# EAGLE design pcm5102dac (EAGLE 6.4)
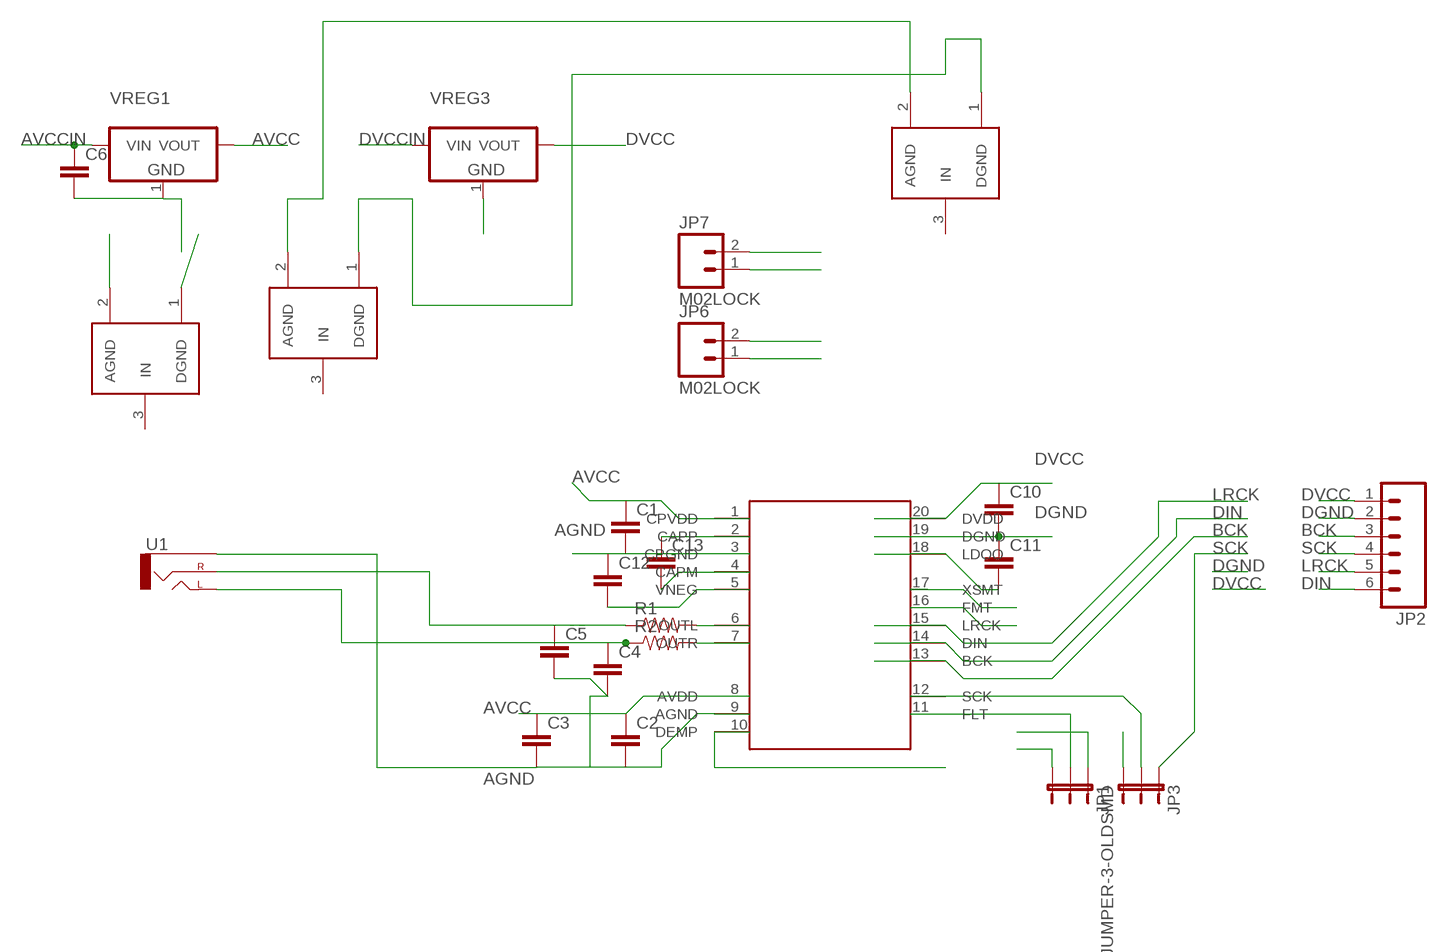
[diagram p0: schematic, sheet 1]

## Parts
C1  CAP0805  [0805]
C2  CAP0805  [0805]
C3  CAP0805  [0805]
C4  CAPPTH1  [CAP-PTH-5MM]
C5  CAPPTH1  [CAP-PTH-5MM]
C6  CAP0805  [0805]
C10  CAP0805  [0805]
C11  CAP0805  [0805]
C12  CAP0805  [0805]
C13  CAP0805  [0805]
JP1  JUMPER-3-OLDPTH  [1X03]
JP2  M06LOCK  [1X06_LOCK]
JP3  JUMPER-3-OLDSMD  [SJ_3]
JP6  M02LOCK  [1X02_LOCK]
JP7  M02LOCK  [1X02_LOCK]
R1  RESISTORPTH-1/4W  [AXIAL-0.4]
R2  RESISTORPTH-1/4W  [AXIAL-0.4]
U1  AUDIO-JACKPTH  [AUDIO-JACK]
U$1  PCM5102  [TSSOP20]
U$2  GND_CONNECT  [GND_CONNECT]
U$3  GND_CONNECT  [GND_CONNECT]
U$4  GND_CONNECT  [GND_CONNECT]
VREG1  VREG_3PINS-SOT-223  [SOT-223]
VREG3  VREG_3PINS-SOT-223  [SOT-223]

## Nets
AGND: C1.2 C2.2 C3.2 C4.2 C5.2 C6.2 C12.1 JP6.1 U1.SLEEVE U$1.3(CPGND) U$1.9(AGND) U$2.2(AGND) U$3.2(AGND) U$4.2(AGND) VREG1.1(GND)
AVCC: C1.1 C2.1 C3.1 U$1.1(CPVDD) U$1.8(AVDD) VREG1.2(VOUT)
AVCCIN: C6.1 JP6.2 VREG1.3(VIN)
BCK: JP2.3 U$1.13(BCK)
DGND: C10.2 C11.1 JP1.1 JP2.2 JP3.3 JP7.1 U$1.10(DEMP) U$1.16(FMT) U$1.19(DGND) U$2.1(DGND) U$3.1(DGND) U$4.1(DGND) VREG3.1(GND)
DIN: JP2.6 U$1.14(DIN)
DVCC: C10.1 JP1.3 JP2.1 U$1.20(DVDD) VREG3.2(VOUT)
DVCCIN: JP7.2 VREG3.3(VIN)
DVDD: U$1.17(XSMT)
LRCK: JP2.5 U$1.15(LRCK)
N$1: C11.2 U$1.18(LDOO)
N$2: R1.P$2 U$1.6(OUTL)
N$3: JP1.2 U$1.11(FLT)
N$5: C13.1 U$1.2(CAPP)
N$6: C13.2 U$1.4(CAPM)
N$7: C12.2 U$1.5(VNEG)
N$8: R2.P$2 U$1.7(OUTR)
N$11: C5.1 R1.P$1 U1.RING(RIGHT)
N$12: C4.1 R2.P$1 U1.TIP(LEFT)
SCK: JP2.4 JP3.1
SCKI: JP3.2 U$1.12(SCK)
Unconnected: U$2.3(IN) U$3.3(IN) U$4.3(IN)

## Library data of the parts
C1-C6 C10-C13 = SparkFun-Capacitors:CAP: Capacitor Standard 0603 ceramic capacitor, and 0.1" leaded capacitor.
JP1 JP3 = SparkFun-Passives:JUMPER-3-OLD
JP2 = SparkFun-Connectors:M06: Header 6 Standard 6-pin 0.1" header. Use with straight break away headers (SKU : PRT-00116), right angle break away headers (PRT-00553), swiss pins (PRT-00743), machine pins (PRT-00117), and female headers (PRT-00115). Molex polarized connector foot print use with SKU : PRT-08094 with associated crimp pins and housings. NOTES ON THE VARIANTS LOCK and LOCK_LONGPADS... This footprint was designed to help hold the alignment of a through-hole component (i.e. 6-pin header) while soldering it into place. You may notice that each hole has been shifted either up or down by 0.005 of an inch from it's more standard position (which is a perfectly straight line). This slight alteration caused the pins (the squares in the middle) to touch the edges of the holes. Because they are alternating, it causes a "brace" to hold the component in place. 0.005 has proven to be the perfect amount of "off-center" position when using our standard breakaway headers. Although looks a little odd when you look at the bare footprint, once you have a header in there, the alteration is very hard to notice. Also,if you push a header all the way into place, it is covered up entirely on the bottom side. This idea of altering the position of holes to aid alignment will be further integrated into the Sparkfun Library for other footprints. It can help hold any component with 3 or more connection pins.
JP6 JP7 = SparkFun-Connectors:M02: Standard 2-pin 0.1" header. Use with - straight break away headers ( PRT-00116) - right angle break away headers (PRT-00553) - swiss pins (PRT-00743) - machine pins (PRT-00117) - female headers (PRT-00115) Molex polarized connector foot print use with: PRT-08233 with associated crimp pins and housings. 2.54_SCREWTERM for use with PRT-10571. 3.5mm Screw Terminal footprints for PRT-08084 5mm Screw Terminal footprints for use with PRT-08433
R1 R2 = SparkFun-Resistors:RESISTOR: Resistor Basic schematic elements and footprints for 0603, 1206, and PTH resistors.
U1 = SparkFun-Connectors:AUDIO-JACK: 3.5mm Audio Jack Simple 3.5mm common PCB mount audio jack. SKU: PRT-08032
U$1 = adafruit:PCM5102
U$2-U$4 = SparkFun-Passives:GND_CONNECT: Use to make a connection of multiple grounds in only one place.
VREG1 VREG3 = dp_devices:VREG_3PINS: Various 3 pin voltage regulators in different packages Double check the right pinout for the right part

## Net classes
0 default: width 0.254 mm

## Board
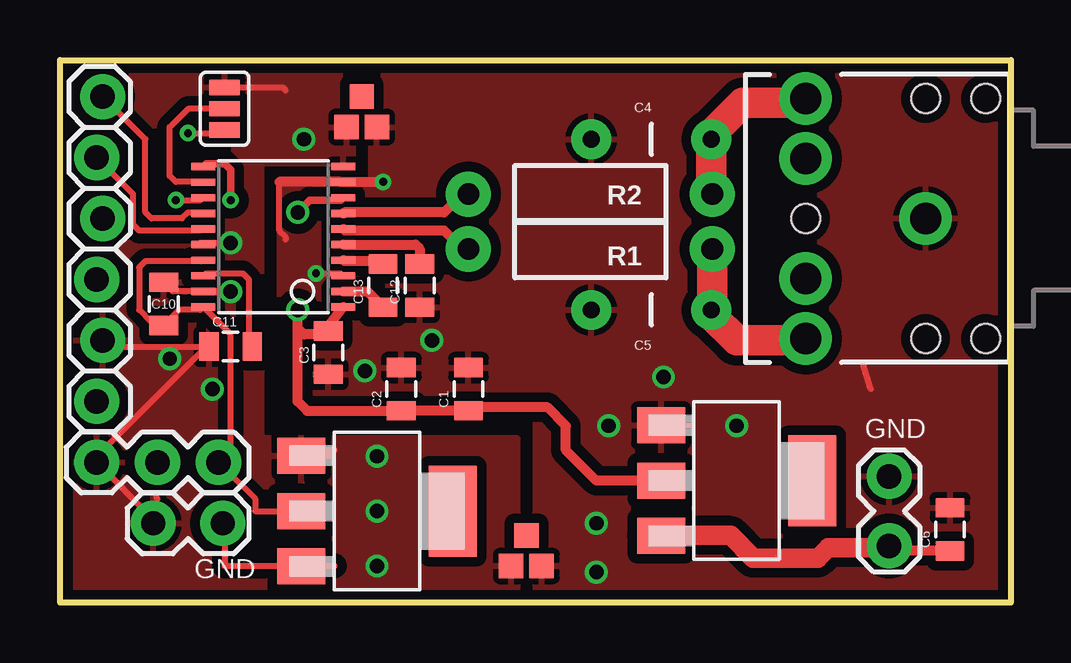
[diagram p1: board, top side]
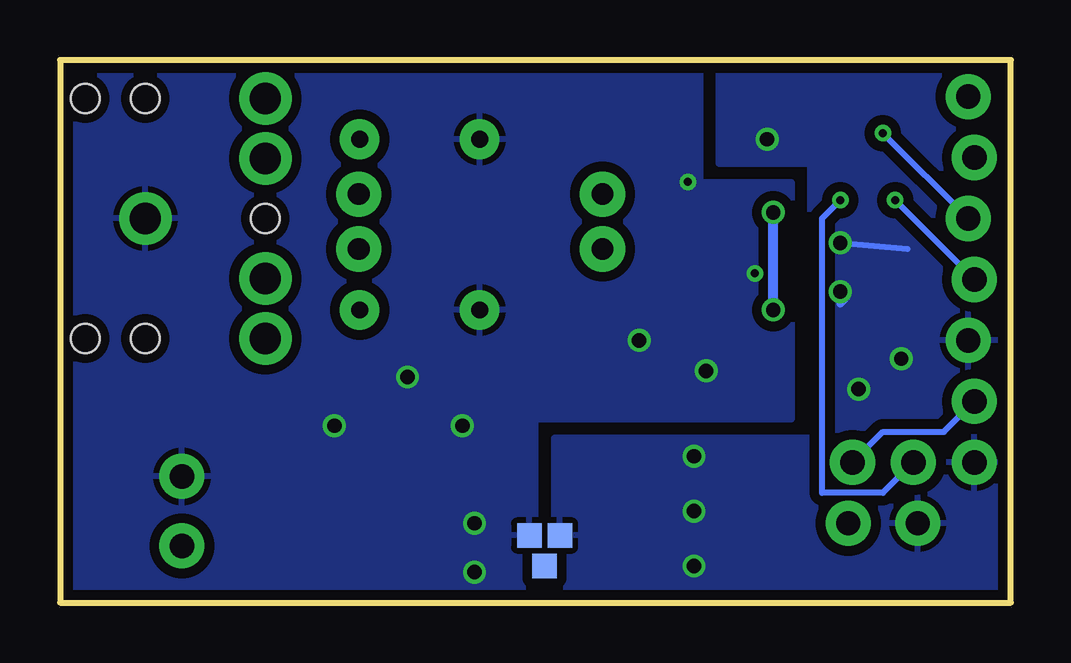
[diagram p2: board, bottom side, seen from below]

Size 39.62 x 22.61 mm. Coordinates in mm from the lower left corner, seen from the top.
Outline: 0,22.61 39.62,22.61 39.62,0 0,0 0,22.61
Copper layers (1*16): Top 0.0356mm / dielectric 1.5011mm / Bottom 0.0356mm
Design rules "LaenPCBOrder *": minimum track width 6mil, minimum drill 13mil, track to track 6mil, track to pad 6mil, pad to pad 6mil, via to via 6mil, smd to smd 6mil, copper to edge 15mil, drill to drill 6mil, minimum pad ring 7mil, minimum via ring 7mil, stop-mask expansion 3mil, vias tented up to drill 3mil, thermal gap 10mil

### Footprints (pad centres in the part's own frame; a part is rotated, then mirrored left to right if it is on the bottom)
0805 = smd 0.8 x 1.2: 1 -0.9,0; 2 0.9,0
CAP-PTH-5MM = drill 0.7 pad 1.651: 1 -2.5,0; 2 2.5,0
1X03 = drill 1.016 pad 1.88: 1 0,0; 2 2.54,0; 3 5.08,0
1X06_LOCK = drill 1.016 pad 1.88: 1 0,0; 2 2.54,-0.254; 3 5.08,0; 4 7.62,-0.254; 5 10.16,0; 6 12.7,-0.254
SJ_3 = smd 0.635 x 1.27: 1 -0.889,0; 2 0,0; 3 0.889,0
1X02_LOCK = drill 1.016 pad 1.88: 1 -0.178,0; 2 2.718,0
AXIAL-0.4 = drill 0.9 pad 1.88: P$1 -5.08,0; P$2 5.08,0
AUDIO-JACK = drill 1.3 pad 2.184: RING 5,5; RSH 5,2.5; SLEEVE 0,0; TIP 5,-5; TSH 5,-2.5 | hole 1.2: 0,5; -2.5,5; -2.5,-5; 0,-5; 5,0
TSSOP20 = smd 0.305 x 0.991: 1 -2.925,-2.918; 2 -2.275,-2.918; 3 -1.625,-2.918; 4 -0.975,-2.918; 5 -0.325,-2.918; 6 0.325,-2.918; 7 0.975,-2.918; 8 1.625,-2.918; 9 2.275,-2.918; 10 2.925,-2.918; 11 2.925,2.918; 12 2.275,2.918; 13 1.625,2.918; 14 0.975,2.918; 15 0.325,2.918; 16 -0.325,2.918; 17 -0.975,2.918; 18 -1.625,2.918; 19 -2.275,2.918; 20 -2.925,2.918
GND_CONNECT = smd 1.016 x 1.016: 1 -1.016,0; 2 -1.016,-1.27; 3 0.254,-0.635
SOT-223 = smd 1.5 x 2: 1 -2.3,-3.15; 2 0,-3.15; 3 2.3,-3.15 | smd 3.8 x 2: 4 0,3.15

### Placement (x,y rotation side)
C1  17.02,8.89 90 top
C2  14.22,8.89 90 top
C3  11.18,10.41 270 top
C4  24.64,19.3 180 top
C5  24.64,12.19 180 top
C6  37.08,3.05 90 top
C10  4.32,12.45 90 top
C11  7.11,10.67 0 top
C12  14.99,13.21 90 top
C13  13.46,13.21 90 top
JP1  1.52,5.84 0 top
JP2  1.52,8.38 90 top
JP3  6.86,20.57 90 top
JP6  34.54,5.08 270 top
JP7  4.06,3.3 0 top
R1  22.1,14.73 180 top
R2  22.1,17.02 180 top
U1  36.07,16 180 top
U$1  8.89,15.24 90 top
U$2  18.8,2.54 90 top
U$3  18.8,1.78 270 bottom
U$4  11.94,20.83 90 top
VREG1  28.19,5.08 270 top
VREG3  13.21,3.81 270 top

### Tracks (layer width: path | path; a pad name or v marks a point on that pad's centre or on a via)
AGND  (via drill 0.33, 0.6)
  Top 0.254: 33.78,8.89 33.45,9.98 | 22.86,12.19 C5.2 | v10.67,13.72 11.68,13.72 U$1.3 | 9.14,17.53 9.14,15.49 9.4,15.24 9.4,15.12 | 11.68,17.53 U$1.9
  Top 0.406: 13.21,17.53 11.68,17.53 9.14,17.53
  other vias: 12.7,9.65 25.15,9.4 22.35,1.27 15.49,10.92 13.46,17.53 22.35,3.3 28.19,7.37 22.86,7.37
  pour Top (isolate 0.406): 12.95,24.89 12.95,17.53 9.14,17.53 9.14,7.62 19.81,7.62 19.81,-2.54 41.66,-2.54 41.66,24.89
  pour Bottom (isolate 0.406): 12.95,24.89 12.95,17.53 9.14,17.53 9.14,7.62 19.81,7.62 19.81,-2.54 41.66,-2.54 41.66,24.89
AVCC  (via drill 0.6)
  Top 0.305: U$1.8 11.71,16.76 10.41,16.76 v9.91,16.26
  Top 0.406: C3.1 10.92,11.18 | 10.92,11.18 U$1.1 | 9.91,11.43 9.91,8.38 10.3,7.99 C2.1 C1.1 17.13,8.13 20.32,8.13 21.08,7.37 21.08,6.35 22.35,5.08 VREG1.2 | 9.91,11.43 v9.91,12.19 | 10.92,11.18 10.16,11.18 9.91,11.43
  Bottom 0.406: v9.91,12.19 v9.91,16.26
AVCCIN
  Top 0.406: VREG1.3 24.25,2.78 | C6.1 34.25,2.15 JP6.2
  Top 0.813: VREG1.3 25.06,2.79 27.94,2.79 28.88,1.85 31.57,1.85 32,2.29 33.96,2.29 JP6.2
BCK  (via drill 0.33)
  Top 0.254: v4.83,16.76 5.84,16.76 U$1.13
  Bottom 0.254: JP2.3 v4.83,16.76
DGND  (via drill 0.6, 0.6 pad 0.3)
  Top 0.254: JP7.1 3.81,3.3 3.81,3.56 JP1.1 1.52,6.1 6.1,10.67 | 6.1,10.67 1.78,10.67 JP2.2 | 6.1,10.67 C11.1 6.35,10.67 | 6.1,12.95 U$1.19 4.7,12.96 C10.2 | 10.67,6.35 11.43,6.35 VREG3.1 | U$1.16 5.84,14.99 v7.11,14.99 | 4.06,4.32 4.01,4.37 | JP3.3 9.27,21.46 9.4,21.34
  Top 0.305: 6.1,12.95 v7.11,12.95
  Bottom 0.254: v7.11,14.99 4.32,14.73
  Bottom 0.305: v7.11,12.95 6.86,12.7 7.11,12.45
  other vias: 4.57,10.16 13.21,6.1 6.35,8.89 10.16,19.3 13.21,1.52 13.21,3.81
  pour Bottom (isolate 0.406): -1.78,24.89 12.19,24.89 12.19,18.29 8.38,18.29 8.38,6.86 19.05,6.86 19.05,-2.54 -1.78,-2.54
  pour Top (isolate 0.406): -1.78,24.13 12.19,24.13 12.19,18.29 8.38,18.29 8.38,6.86 19.05,6.86 19.05,-2.54 -1.78,-2.54
DIN
  Top 0.254: JP2.6 3.56,19.3 3.56,16.26 3.81,16 5.08,16 5.33,16.26 5.84,16.26 U$1.14
DVCC
  Top 0.254: VREG3.2 8.13,3.81 8.13,4.32 7.11,5.33 | C10.1 4.96,12.19 5.84,12.19 U$1.20 6.1,12.19 7.11,11.18 7.11,5.33 | 7.11,5.33 JP1.3
  Bottom 0.254: JP2.1 2.79,7.11 5.33,7.11 JP1.3
DVCCIN
  Top 0.254: VREG3.3 11.43,1.52 6.86,1.52 6.86,3.3 JP7.2
DVDD
  Top 0.254: U$1.17 5.84,14.22 3.56,14.22 3.3,13.97 3.3,12.19 3.81,11.68 4.32,11.68
LRCK
  Top 0.254: JP2.5 3.05,17.02 3.05,15.75 3.3,15.49 5.84,15.49 U$1.15
N$1
  Top 0.254: U$1.18 6.1,13.72 7.62,13.72 7.87,13.46 7.87,10.81 C11.2 7.87,10.67
N$2
  Top 0.406: R1.P$2 16.76,14.73 16,15.49 11.88,15.49 U$1.6
N$3  (via drill 0.33)
  Top 0.305: v7.11,16.76 7.11,18.03 6.86,18.29 6.1,18.29 U$1.11
  Bottom 0.254: v7.11,16.76 7.87,16 7.87,4.57 5.33,4.57 JP1.2
N$5
  Top 0.406: U$1.2 12.81,12.96 C13.1
N$6
  Top 0.406: C13.2 13.32,14.11 13.21,14.22 11.85,14.22 U$1.4
N$7
  Top 0.406: U$1.5 14.8,14.91 14.99,14.73 C12.2
N$8
  Top 0.406: R2.P$2 16.76,17.02 16,16.26 11.85,16.26 U$1.7
N$11
  Top 1.27: R1.P$1 27.18,12.23 C5.1 27.14,11.98 28.19,10.92 30.99,10.92 U1.RING
N$12
  Top 1.27: R2.P$1 27.14,17.06 C4.1 27.14,19.52 28.45,20.83 30.89,20.83 U1.TIP
SCK  (via drill 0.33)
  Top 0.254: v5.33,19.56 6.86,19.56 JP3.1
  Bottom 0.254: JP2.4 v5.33,19.56
SCKI
  Top 0.254: JP3.2 5.33,20.57 4.57,19.81 4.57,17.78 4.83,17.53 5.84,17.53 U$1.12

### Text on the board
tNames: GND | GND
tValues: DIN | LRCK | SCK | BCK | GND | FLT